# Altium schematic sheet NGNIv1_32.SchDoc
size A4
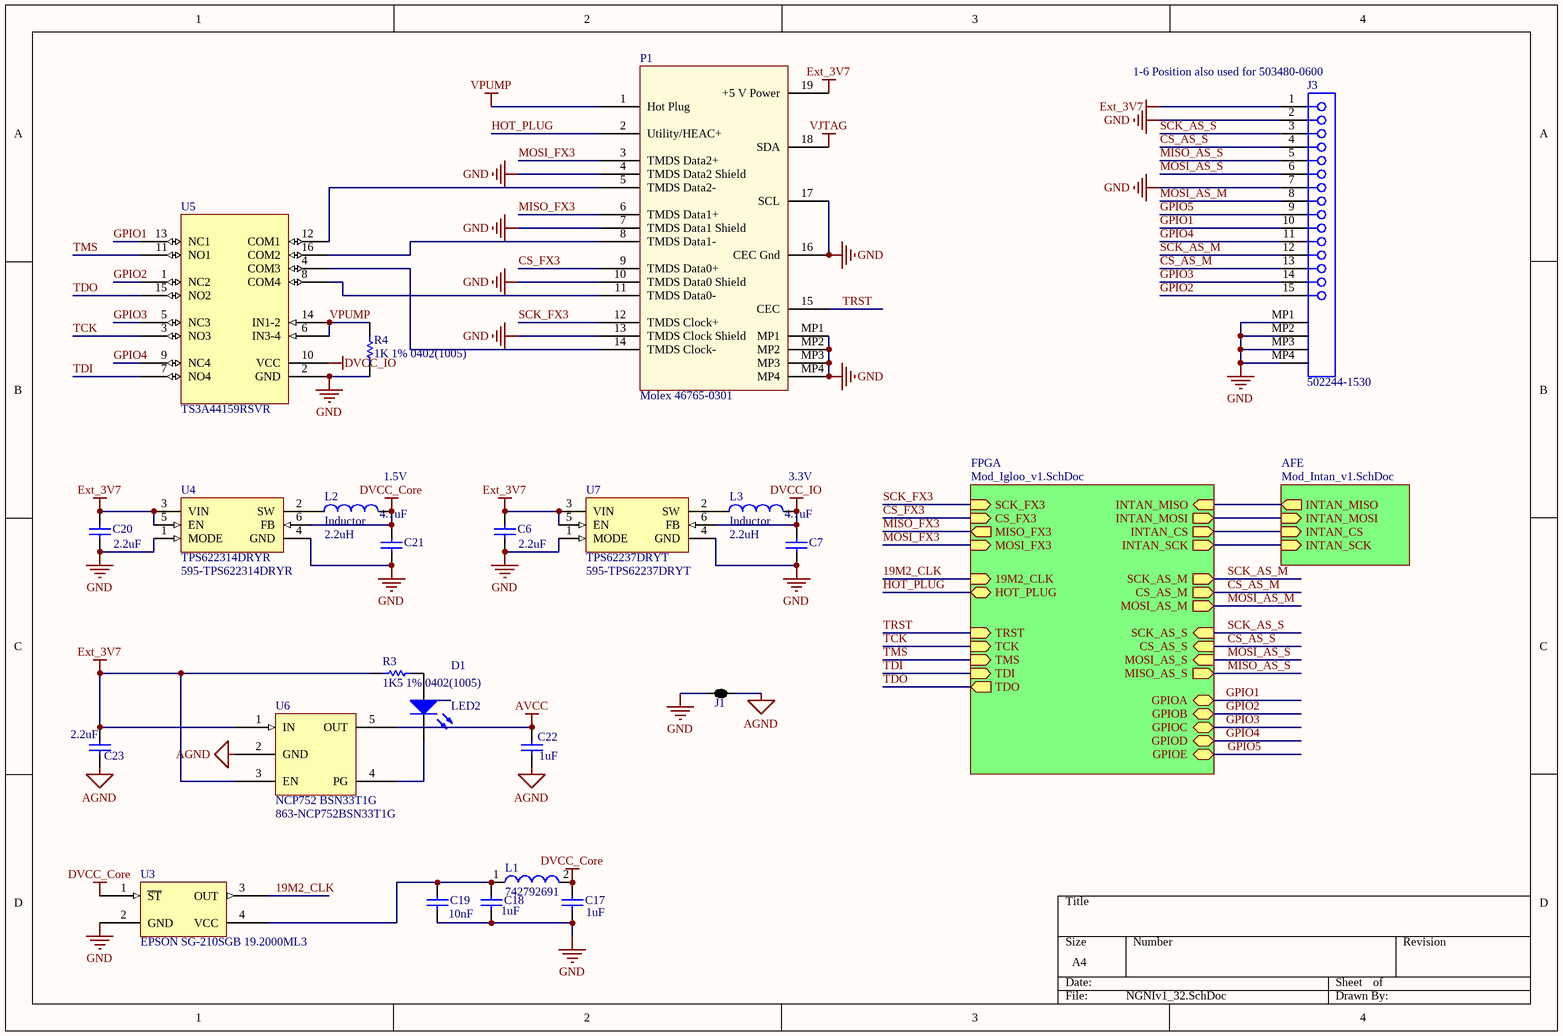
[diagram p0: NGNIv1_32.SchDoc]

## Parts
C6  value 2.2uF  [CAPC0402(1005)60_L]  (hidden comment: CAP 2.2uF 10V 0402(1005))
C7  value 4.7uF  [CAPC0402(1005)60_N]  (hidden comment: CAP 4.7uF 6.3V 0402(1005))
C17  value 1uF  [CAPC0402(1005)60_L]  (hidden comment: CAP 1uF 16V 0402(1005))
C18  value 1uF  [CAPC0402(1005)60_L]  (hidden comment: CAP 1uF 16V 0402(1005))
C19  value 10nF  [CAPC0402(1005)60_L]  (hidden comment: CAP 10nF 25V 0402(1005))
C20  value 2.2uF  [CAPC0402(1005)60_L]  (hidden comment: CAP 2.2uF 10V 0402(1005))
C21  value 4.7uF  [CAPC0402(1005)60_N]  (hidden comment: CAP 4.7uF 6.3V 0402(1005))
C22  value 1uF  [CAPC0402(1005)60_L]  (hidden comment: CAP 1uF 16V 0402(1005))
C23  value 2.2uF  [CAPC0603(1608)100_L]  (hidden comment: CAP 2.2uF 25V 0603(1608))
D1  LED2  [LED 0610]
J1  2 way net tie junction  [2way_micro]  (value not drawn)  (net tie, no BOM)
J3  502244-1530  [MOLX-502244-1530]
L1  742792691  [SMD-0603]
L2  Inductor  value 2.2uH  [2029]
L3  Inductor  value 2.2uH  [2029]
P1  Molex 46765-0301  [MOLEX 0467650301]
R3  1K5 1% 0402(1005)  [RESC0402(1005)_L]
R4  1K 1% 0402(1005)  [RESC0402(1005)_L]
U3  EPSON SG-210SGB 19.2000ML3  [SG-210S*B]
U4  TPS622314DRYR  Supplier Part Number 1: 595-TPS622314DRYR  [DRY0006A]
U5  TS3A44159RSVR  [UQFN-4]
U6  NCP752 BSN33T1G  Supplier Part Number 1: 863-NCP752BSN33T1G  [TSOP5 NCP752]
U7  TPS62237DRYT  Supplier Part Number 1: 595-TPS62237DRYT  [DRY0006A]

## Sub-sheets
AFE = Mod_Intan_v1.SchDoc: INTAN_MISO (out), INTAN_MOSI (in), INTAN_CS (in), INTAN_SCK (in)
FPGA = Mod_Igloo_v1.SchDoc: CS_AS_M (out), SCK_AS_S (in), HOT_PLUG, SCK_AS_M (out), CS_AS_S (in), SCK_FX3 (in), MISO_FX3 (out), MOSI_AS_S (in), INTAN_MOSI (out), 19M2_CLK (in), MOSI_AS_M (out), MISO_AS_S (out), INTAN_MISO (in), TRST (in), MOSI_FX3 (in), TDO (out), TMS (in), CS_FX3 (in), TCK (in), INTAN_CS (out), INTAN_SCK (out), TDI (in), GPIOA, GPIOC, GPIOE, GPIOB, GPIOD

## Nets
AGND: C22.1 C23.1 J1.2 U6.2(GND)
AVCC: C22.2 U6.5(OUT)
DVCC_Core: C17.2 C21.1 L1.2 L2.2 U3.1(~{ST}) U4.6(FB)
DVCC_IO: C7.1 L3.2 U5.10(VCC) U7.6(FB)
Ext_3V7: C6.2 C20.2 C23.2 J3.1 P1.19(+5_V_Power) R3.1 U4.3(VIN) U4.5(EN) U6.1(IN) U6.3(EN) U7.3(VIN) U7.5(EN)
GND: C6.1 C7.2 C17.1 C18.1 C19.1 C20.1 C21.2 J1.1 J3.2 J3.7 J3.MP1 J3.MP2 J3.MP3 J3.MP4 P1.4(TMDS_Data2_Shield) P1.7(TMDS_Data1_Shield) P1.10(TMDS_Data0_Shield) P1.13(TMDS_Clock_Shield) P1.16(CEC_Gnd) P1.17(SCL) P1.MP1 P1.MP2 P1.MP3 P1.MP4 R4.2 U3.2(GND) U4.1(MODE) U4.4(GND) U5.2(GND) U7.1(MODE) U7.4(GND)
VJTAG: P1.18(SDA)
VPUMP: P1.1(Hot_Plug) R4.1 U5.6(IN3-4) U5.14(IN1-2)
19M2_CLK: U3.3(OUT) ; sheet FPGA/19M2_CLK
CS_AS_M: J3.13 ; sheet FPGA/CS_AS_M
CS_AS_S: J3.4 ; sheet FPGA/CS_AS_S
CS_FX3: P1.9(TMDS_Data0+) ; sheet FPGA/CS_FX3
GPIO1: J3.10 U5.13(NC1) ; sheet FPGA/GPIOA
GPIO2: J3.15 U5.1(NC2) ; sheet FPGA/GPIOB
GPIO3: J3.14 U5.5(NC3) ; sheet FPGA/GPIOC
GPIO4: J3.11 U5.9(NC4) ; sheet FPGA/GPIOD
GPIO5: J3.9 ; sheet FPGA/GPIOE
HOT_PLUG: P1.2(Utility/HEAC+) ; sheet FPGA/HOT_PLUG
MISO_AS_S: J3.5 ; sheet FPGA/MISO_AS_S
MISO_FX3: P1.6(TMDS_Data1+) ; sheet FPGA/MISO_FX3
MOSI_AS_M: J3.8 ; sheet FPGA/MOSI_AS_M
MOSI_AS_S: J3.6 ; sheet FPGA/MOSI_AS_S
MOSI_FX3: P1.3(TMDS_Data2+) ; sheet FPGA/MOSI_FX3
SCK_AS_M: J3.12 ; sheet FPGA/SCK_AS_M
SCK_AS_S: J3.3 ; sheet FPGA/SCK_AS_S
SCK_FX3: P1.12(TMDS_Clock+) ; sheet FPGA/SCK_FX3
TCK: U5.3(NO3) ; sheet FPGA/TCK
TDI: U5.7(NO4) ; sheet FPGA/TDI
TDO: U5.15(NO2) ; sheet FPGA/TDO
TMS: U5.11(NO1) ; sheet FPGA/TMS
TRST: P1.15(CEC) ; sheet FPGA/TRST
NetC18_2: C18.2 C19.2 L1.1 U3.4(VCC)
NetD1_1: D1.1(A) R3.2
NetD1_2: D1.2(K) U6.4(PG)
NetL2_1: L2.1 U4.2(SW)
NetL3_1: L3.1 U7.2(SW)
NetP1_5: P1.5(TMDS_Data2-) U5.12(COM1)
NetP1_8: P1.8(TMDS_Data1-) U5.16(COM2)
NetP1_11: P1.11(TMDS_Data0-) U5.8(COM4)
NetP1_14: P1.14(TMDS_Clock-) U5.4(COM3)
(unnamed): sheet FPGA/INTAN_MOSI, sheet AFE/INTAN_MOSI
(unnamed): sheet FPGA/INTAN_MISO, sheet AFE/INTAN_MISO
(unnamed): sheet FPGA/INTAN_CS, sheet AFE/INTAN_CS
(unnamed): sheet FPGA/INTAN_SCK, sheet AFE/INTAN_SCK

## Notes on the sheet
- (near J3) 1-6 Position also used for 503480-0600
- (near L2) 1.5V
- (near L3) 3.3V

## Library data of the parts
C6 C20 = CMP-1034-02128-1: CAP 2.2uF 10V Â±20% 0402 (1005 Metric) Thickness 0.6mm SMD; Case-Metric: 1005; Case-EIA: 0402; Rated Voltage: 10 V; Max Thickness: 0.6 mm; Technology: SMT; Tolerance: Â±20%
C7 C21 = CMP-1034-02137-1: CAP 4.7uF 6.3V Â±20% 0402 (1005 Metric) Thickness 0.6mm SMD; Case-Metric: 1005; Case-EIA: 0402; Technology: SMT; Max Thickness: 0.6 mm; Tolerance: Â±20%; Rated Voltage: 6.3 V
C17 = CMP-1034-02119-1: CAP 1uF 16V Â±10% 0402 (1005 Metric) Thickness 0.6mm SMD; Case-EIA: 0402; Case-Metric: 1005; Max Thickness: 0.6 mm; Tolerance: Â±10%; Rated Voltage: 16 V; Technology: SMT
C18 = CMP-1034-02120-1: CAP 1uF 16V Â±20% 0402 (1005 Metric) Thickness 0.6mm SMD; Case-EIA: 0402; Case-Metric: 1005; Max Thickness: 0.6 mm; Tolerance: Â±20%; Rated Voltage: 16 V; Technology: SMT
C19 = CMP-1034-01879-1: CAP 10nF 25V ±5% 0402 (1005 Metric) Thickness 0.6mm SMD; Case-Metric: 1005; Case-EIA: 0402; Max Thickness: 0.6 mm; Rated Voltage: 25 V; Tolerance: ±5%; Technology: SMT
C22 = CMP-1034-02119-1: CAP 1uF 16V ±10% 0402 (1005 Metric) Thickness 0.6mm SMD; Case-Metric: 1005; Technology: SMT; Tolerance: ±10%
C23 = CMP-1035-02767-1: CAP 2.2uF 25V ±10% 0603 (1608 Metric) Thickness 1mm SMD; Case-Metric: 1608; Technology: SMT; Tolerance: ±10%
D1 = LED2: Typical RED, GREEN, YELLOW, AMBER GaAs LED; Published: 8-Jun-2000; LatestRevisionDate: 17-Jul-2002; LatestRevisionNote: Re-released for DXP Platform.; PackageVersion: Feb-2002; PackageReference: 3.2X1.6X1.1; Publisher: Altium Limited; PackageDescription: SM LED; 2 Flat Leads
J1 = 2way: ComponentLink1URL: http://www.edatools.cz/addons; ComponentLink1Description: Source; FootprintNote: LP=12mil, MP=40mil, HP=120mil
J3 = MOLX-502244-1530
L1 = CMP-0220-00115-1: SMD EMI Suppression Ferrite Bead WE-CBF, Z = 1500 Ohm; DatasheetVersion: Dec-2005; ComponentLink1URL: http://www.we-online.com; PackageVersion: 2009; PackageDescription: Chip Inductor, 2-Leads, Body 1.6 x 0.8 mm; ComponentLink2URL: http://www.we-online.de/katalog/media/pdf/742792691.pdf; ComponentLink1Description: Manufacturer Link; ComponentLink2Description: Datasheet; Impedance: 1500 Ohm; PackageReference: SMD-0603
L2 L3 = Inductor: LQM21PN2R2; Code_IEC: 1005; Published: 8-Jun-2000; LatestRevisionDate: 29-May-2009; LatestRevisionNote: IPC-7351 Footprint Added.; PackageReference: 0402-A; Publisher: Altium Limited; PackageDescription: Chip Inductor; Code_JEITA: 0402
P1 = Molex 46765-0301: Micro HDMI
R3 = CMP-1011-00528-1: 1K5 0.063W 1% 0402 (1005 Metric)  SMD; Case-Metric: 1005; Value: 1500.00 Ohm; Case-EIA: 0402; Tolerance: 1 %; Power: 0.063 W; Technology: SMT
R4 = CMP-1011-00510-1: 1K 0.063W 1% 0402 (1005 Metric)  SMD; Value: 1000.00 Ohm; Case-Metric: 1005; Case-EIA: 0402; Technology: SMT; Tolerance: 1 %; Power: 0.063 W
U4 = TPS622314DRYR: Voltage Regulators - Switching Regulators 3MHz,500mA Step- Down Converter; Manufacturer: Texas Instruments; CompType: IC; PIN_COUNT: 6; Input Voltage: 2.05 V to 6 V; Input Voltage MAX: 6 V; Number of Outputs: 1 Output; Output Voltage: 1.5 V; Topology: Buck; Input Voltage MIN: 2.05 V; PartNumber: TPS622314DRY; PackageReference: DRY0006A; MountType: SMT; RoHS: Y; RefDes: RefDes; Type: DEV; Value: Value; Supplier 1: Mouser; Manufacturer Part Number: TPS622314DRYR; Category: Voltage Regulators - Switching Regulators; Stock 1: 0; Pricing 1: 5000=0.901 (AUD); Operating Temperature Range: - 40 C to + 85 C; Output Current: 500 mA; Package / Case: USON-6; Packaging: Reel; Series: TPS622314; Brand: Texas Instruments; Mounting Style: SMD/SMT; Switching Frequency: 3 MHz; Maximum Operating Temperature: + 85 C; Minimum Operating Temperature: - 40 C; Product Category: Converters - DC/DC; Standard Pack Qty: 5000; RoHS - Mouser: Y; Minimum Order Quantity: 5000; Reeling: True; ComponentLink1URL: http://www.mouser.com/ds/2/405/tps622314-448767.pdf; ComponentLink1Description: http://www.mouser.com/ds/2/405/tps622314-448767.pdf
U5 = TS3A44159RSVR: 0.45-Ω Quad SPDT Analog Switch 4-Channel 2:1 Multiplexer – Demultiplexer  With Two Controls
U6 = NCP752 BSN33T1G: 3.3V LDO 200ma ultra low quiescent current, ultra low noise; Supplier 1: Mouser
U7 = TPS62237DRYT: Voltage Regulators - Switching Regulators 3MHz,500mA Step- Down Converter; PartNumber: TPS622314DRY; Manufacturer: Texas Instruments; Manufacturer Part Number: TPS622314DRYR; CompType: IC; PIN_COUNT: 6; Input Voltage: 2.05 V to 6 V; Input Voltage MAX: 6 V; Number of Outputs: 1 Output; Output Voltage: 1.5 V; Topology: Buck; Input Voltage MIN: 2.05 V; PackageReference: DRY0006A; MountType: SMT; RoHS: Y; RefDes: RefDes; Type: DEV; Value: Value; Category: Voltage Regulators - Switching Regulators; Operating Temperature Range: - 40 C to + 85 C; Output Current: 500 mA; Package / Case: USON-6; Packaging: Reel; Series: TPS622314; Brand: Texas Instruments; Mounting Style: SMD/SMT; Switching Frequency: 3 MHz; Maximum Operating Temperature: + 85 C; Minimum Operating Temperature: - 40 C; Product Category: Converters - DC/DC; Standard Pack Qty: 5000; RoHS - Mouser: Y; Minimum Order Quantity: 5000; Reeling: True; ComponentLink1URL: http://www.mouser.com/ds/2/405/tps622314-448767.pdf; ComponentLink1Description: http://www.mouser.com/ds/2/405/tps622314-448767.pdf; Supplier 1: Mouser